# EAGLE design LoRa-Bee_v10 (EAGLE 7.7.0)
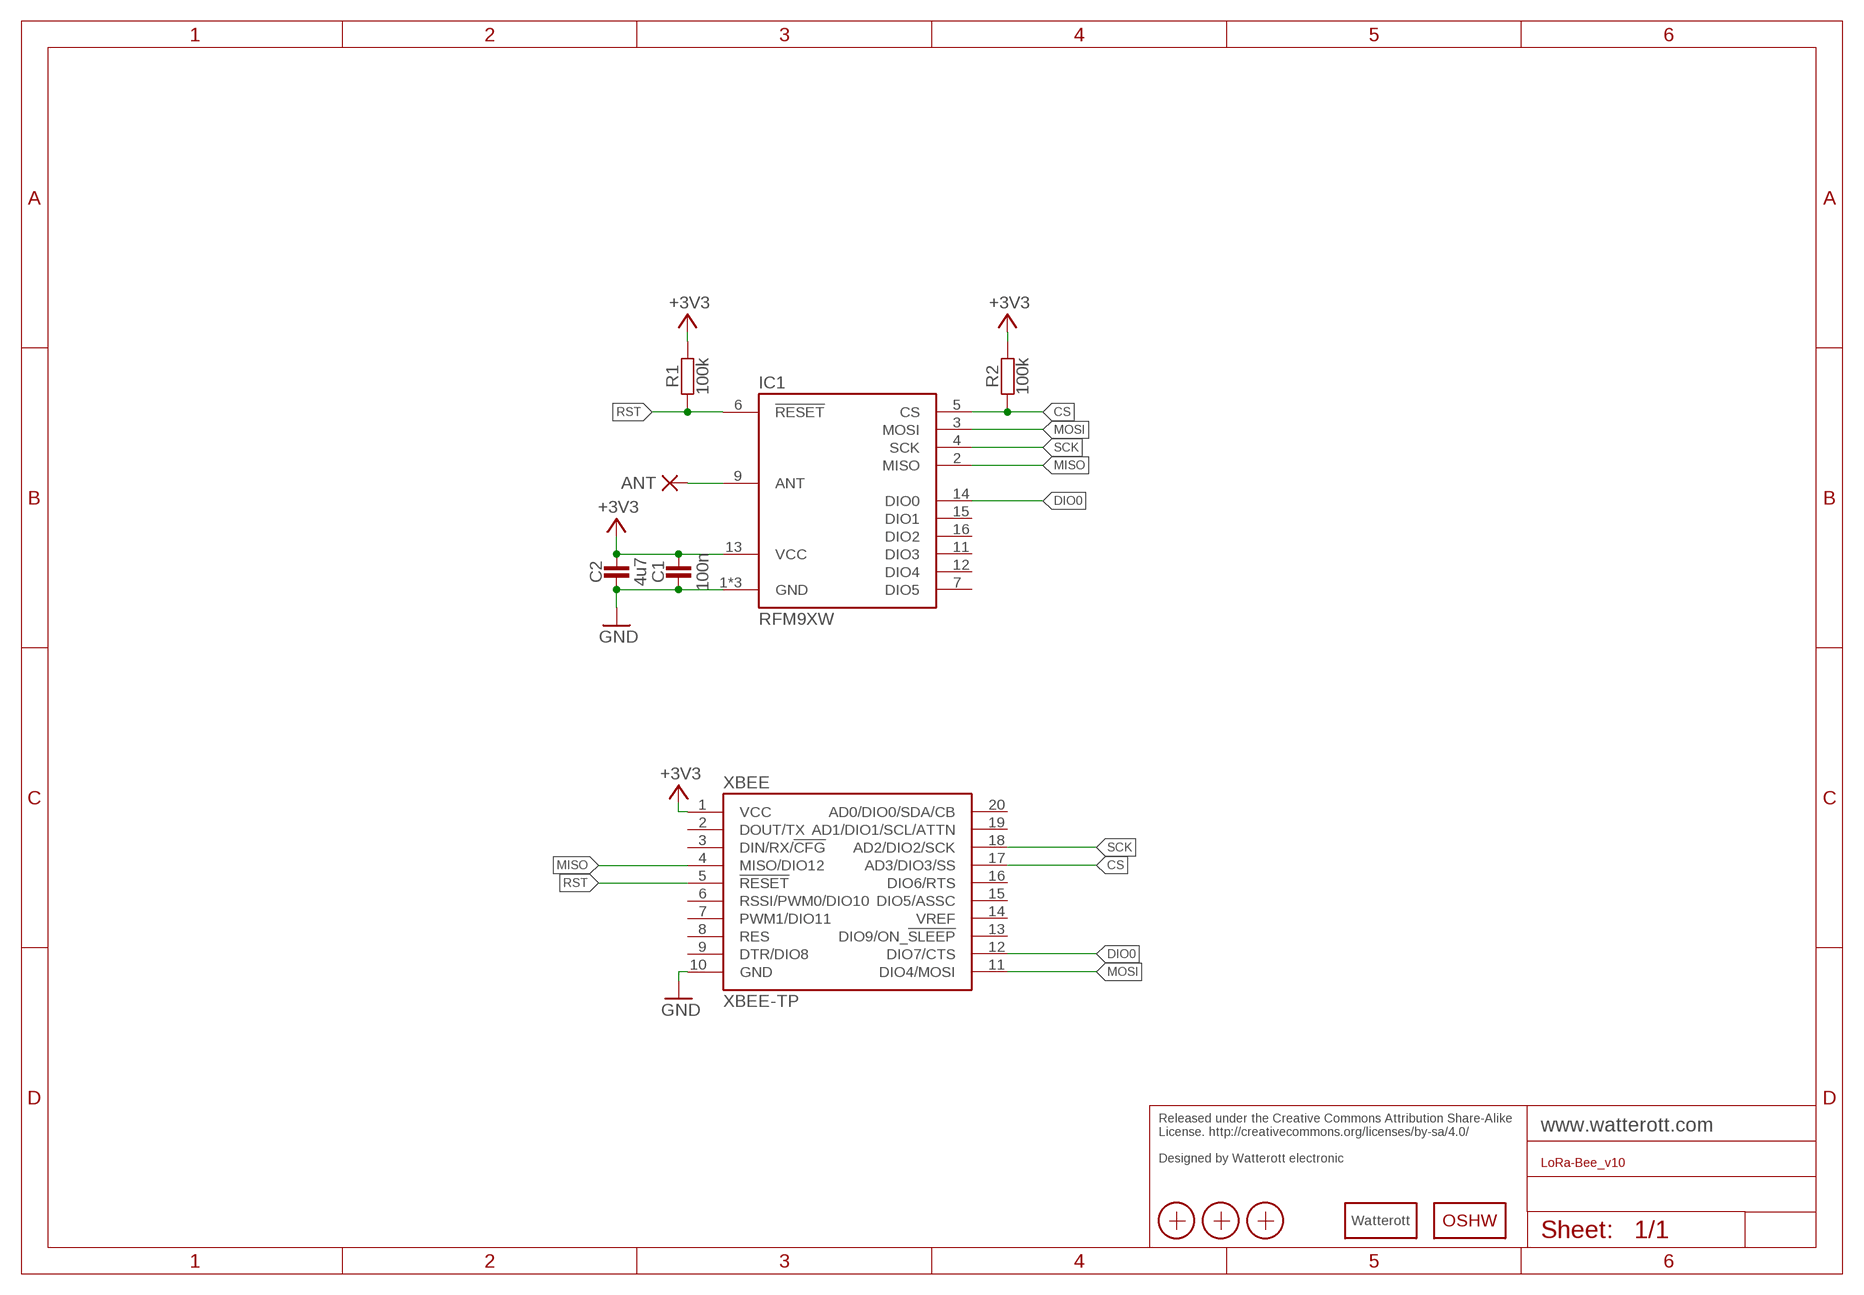
[diagram p0: schematic, sheet 1]

## Parts
ANT  PAD-1.00-1.60  [PAD-1.00-1.60]
C1  100n  CAPACITOR-0402  [C0402]
C2  4u7  CAPACITOR-0402  [C0402]
IC1  RFM9XW  [RFM9X]
LOGO2  OSHW_LOGOX0070  [OSHW_6X70]
LOGO3  LOGO_SPARK-2  [SPARK_2MM]
R1  100k  RESISTOR-0402  [C0402]
R2  100k  RESISTOR-0402  [C0402]
X1  PASSER-07  [PASSER_07MM]
X2  PASSER-07  [PASSER_07MM]
X3  PASSER-07  [PASSER_07MM]
XBEE  XBEE-TP  [XBEE_TP]

## Nets
+3V3: C1.2 C2.2 IC1.13(VCC) R1.2 R2.2 XBEE.1(VCC)
ANT: ANT.1(P) IC1.9(ANT)
CS: IC1.5(CS) R2.1 XBEE.17(AD3/DIO3/SS)
DIO0: IC1.14(DIO0) XBEE.12(DIO7/CTS)
GND: C1.1 C2.1 IC1.1(GND) IC1.8(GND) IC1.10(GND) XBEE.10(GND)
MISO: IC1.2(MISO) XBEE.4(MISO/DIO12)
MOSI: IC1.3(MOSI) XBEE.11(DIO4/MOSI)
RST: IC1.6(!RESET) R1.1 XBEE.5(!RESET!)
SCK: IC1.4(SCK) XBEE.18(AD2/DIO2/SCK)
Unconnected: IC1.7(DIO5) IC1.11(DIO3) IC1.12(DIO4) IC1.15(DIO1) IC1.16(DIO2) XBEE.2(DOUT/TX) XBEE.3(DIN/RX/!CFG!) XBEE.6(RSSI/PWM0/DIO10) XBEE.7(PWM1/DIO11) XBEE.8(RES) XBEE.9(DTR/DIO8) XBEE.13(DIO9/ON_!SLEEP!) XBEE.14(VREF) XBEE.15(DIO5/ASSC) XBEE.16(DIO6/RTS) XBEE.19(AD1/DIO1/SCL/ATTN) XBEE.20(AD0/DIO0/SDA/CB)

## Notes on the sheet
- Released under the Creative Commons Attribution Share-Alike 
  License. http://creativecommons.org/licenses/by-sa/4.0/
  
  Designed by Watterott electronic

## Library data of the parts
ANT = we-rcl:PAD: Pads and Test-Points
C1 C2 = we-rcl:CAPACITOR: Capacitors ...2.2uF @ 6.3V -> 0402 ...4.7uF @ 6.3V -> 0603 ...10uF @ 16V -> 0805 ...22uF @ 25V -> 1206
IC1 = we-chip:RFM9X: Hope RR FM9xW Lora Module
LOGO2 = we-symbol:OSHW_LOGO: Open-Source-Hardware Logo
LOGO3 = we-symbol:LOGO_SPARK: Watterott electronic Logo
R1 R2 = we-rcl:RESISTOR: Resistors all kinds in 0402 and 0603
X1-X3 = we-symbol:PASSER: Fiducial Markers
XBEE = we-board:XBEE: XBEE connector

## Board
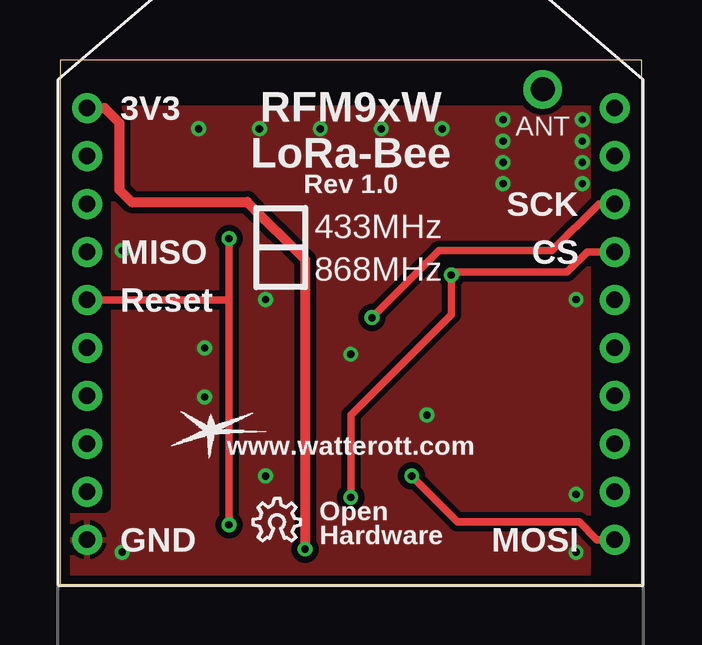
[diagram p1: board, top side]
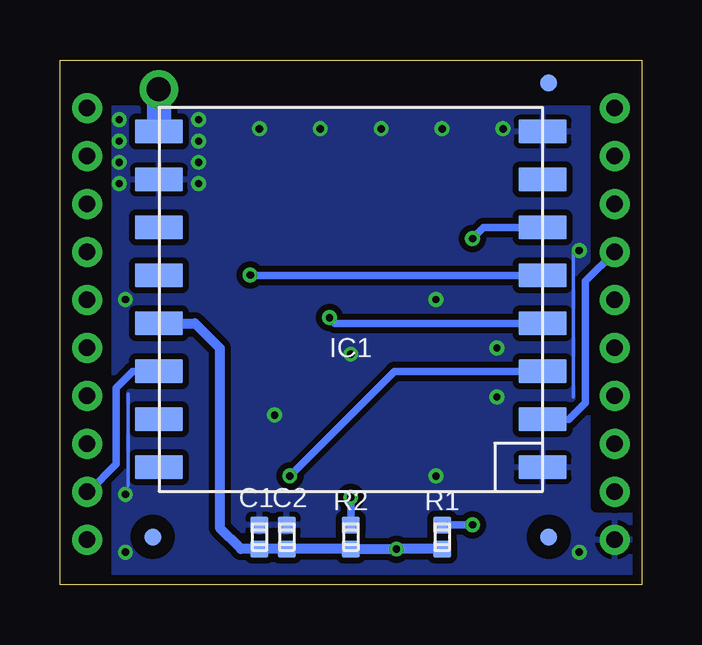
[diagram p2: board, bottom side, seen from below]

Size 24.25 x 21.88 mm. Coordinates in mm from the lower left corner, seen from the top.
Outline: 24.25,0 24.25,21.88 0,21.88 0,0 24.25,0
Copper layers (1*16): Top 0.035mm / dielectric 1.5mm / Bottom 0.035mm
Design rules "we-dru-2-layer *": minimum track width 0.15mm, minimum drill 0.3mm, track to track 0.15mm, track to pad 0.15mm, pad to pad 0.15mm, via to via 0.15mm, smd to smd 0.1mm, copper to edge 0.4mm, drill to drill 0.2mm, minimum pad ring 0.18mm, minimum via ring 0.16mm, stop-mask expansion 0.1mm, vias tented up to drill 0.5mm, thermal gap 0.2mm
tRestrict: area 0.4,3.2 to 1.9,20.8; area 22.4,0.4 to 23.9,20.8
bRestrict: area 0.4,3.2 to 1.9,20.8; area 22.4,0.4 to 23.9,20.8

### Footprints (pad centres in the part's own frame; a part is rotated, then mirrored left to right if it is on the bottom)
PAD-1.00-1.60 = drill 1 pad 1.6: 1 0,0
C0402 = smd 0.75 x 0.7: 1 0,0.5; 2 0,-0.5
RFM9X = smd 2 x 1: 1 -8,7; 2 -8,5; 3 -8,3; 4 -8,1; 5 -8,-1; 6 -8,-3; 7 -8,-5; 8 -8,-7; 9 8,-7; 10 8,-5; 11 8,-3; 12 8,-1; 13 8,1; 14 8,3; 15 8,5; 16 8,7
PASSER_07MM = smd 0.7 x 0.7: X 0,0
XBEE_TP = drill 0.7 pad 1.25: 1 -11,9; 2 -11,7; 3 -11,5; 4 -11,3; 5 -11,1; 6 -11,-1; 7 -11,-3; 8 -11,-5; 9 -11,-7; 10 -11,-9; 11 11,-9; 12 11,-7; 13 11,-5; 14 11,-3; 15 11,-1; 16 11,1; 17 11,3; 18 11,5; 19 11,7; 20 11,9

### Placement (x,y rotation side)
ANT  20.13,20.65 0 top
C1  15.94,1.98 0 bottom
C2  14.79,1.98 0 bottom
IC1  12.12,11.89 180 bottom
LOGO2  8.06,1.83 0 top
LOGO3  6.28,6.43 0 top
R1  8.31,1.98 0 bottom
R2  12.12,1.98 0 bottom
X1  3.87,1.98 0 bottom
X2  3.87,20.91 0 bottom
X3  20.38,1.98 0 bottom
XBEE  12.12,10.88 0 top

### Tracks (layer width: path | path; a pad name or v marks a point on that pad's centre or on a via)
+3V3  (via drill 0.3)
  Top 0.406: v10.22,1.48 10.22,13.54 7.81,15.96 2.98,15.96 2.47,16.46 2.47,19.26 1.86,19.88 XBEE.1
  Bottom 0.406: R1.2 v10.21,1.48 v10.22,1.48 R2.2 C2.2 C1.2 16.7,1.48 17.59,2.37 17.59,9.86 18.62,10.89 IC1.13
ANT
  Bottom 1.016: IC1.9 ANT.1
CS  (via drill 0.3)
  Top 0.305: XBEE.17 21.98,13.88 21.14,13.03 16.44,13.03 v16.32,12.91 16.32,11.26 12.12,7.06 v12.12,3.64
  Bottom 0.305: R2.1 v12.12,3.64 | IC1.5 16.3,12.89 v16.32,12.91
DIO0
  Bottom 0.305: XBEE.12 23.06,3.88 21.9,5.03 21.9,8.21 21.22,8.89 IC1.14
GND  (via drill 0.3)
  Bottom 0.152: 2.85,13.8 2.85,7.83 | 21.4,7.95 21.4,4.14
  other vias: 8.31,19 6.03,7.83 18.48,17.61 13.39,19 18.48,18.5 10.86,19 21.78,17.61 18.48,16.72 21.78,18.5 15.94,19 21.78,19.38 18.48,19.38 21.52,1.35 21.78,16.72 2.6,1.35 8.57,4.53 15.3,7.06 5.78,19 6.03,9.86 8.57,11.89 2.6,13.92 12.12,9.61 21.52,3.76 21.52,11.89
  pour Top (isolate 0.254): 24.25,0 0,0 0,19.88 24.25,19.88
  pour Bottom (isolate 0.254): 0,0 24.25,0 24.25,19.88 0,19.88
MISO
  Bottom 0.305: XBEE.4 2.35,12.65 2.35,7.57 3.03,6.89 IC1.2
MOSI  (via drill 0.3)
  Top 0.305: v14.66,4.53 16.57,2.62 21.65,2.62 22.39,1.88 XBEE.11
  Bottom 0.305: IC1.3 10.3,8.89 v14.66,4.53
RST  (via drill 0.3)
  Top 0.305: v7.04,14.43 7.04,11.76 | 7.04,11.76 v7.04,2.49 | XBEE.5 6.93,11.88 7.04,11.76
  Bottom 0.305: IC1.6 6.58,14.89 v7.04,14.43 | v7.04,2.49 R1.1
SCK  (via drill 0.3)
  Top 0.305: XBEE.18 22.46,15.88 20.51,13.92 15.81,13.92 v13.01,11.13
  Bottom 0.305: IC1.4 12.78,10.89 v13.01,11.13

### Text on the board
tPlace: 3V3 | RFM9xW / LoRa-Bee | Rev 1.0 | SCK | 433MHz | MISO | CS | 868MHz | Reset | www.watterott.com | Open | GND | Hardware | MOSI
Reference: Silkscreen: 21 tPlace